# EAGLE design 3v3converter (EAGLE 6.6.0)
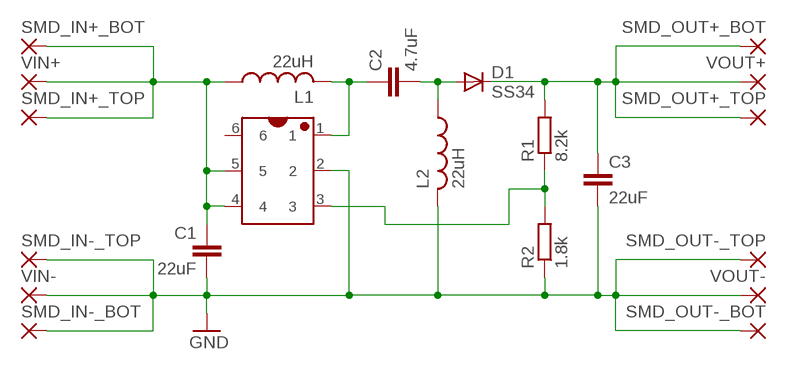
[diagram p0: schematic, sheet 1]

## Parts
C1  22uF  C-EUC0805  [C0805]
C2  4.7uF  C-EUC0603  [C0603]
C3  22uF  C-EUC0805  [C0805]
D1  SS34  DIODE-DO214BA  [DO214BA]
L1  22uH  L-USFPS  [FPS]
L2  22uH  L-USFPS  [FPS]
MT3608  mt3608  SOT-23-6  [SOT-23-6]
R1  8.2k  R-EU_R0603  [R0603]
R2  1.8k  R-EU_R0603  [R0603]
SMD_IN+_BOT  SMD5  [SMD2,54-5,08]
SMD_IN+_TOP  SMD5  [SMD2,54-5,08]
SMD_IN-_BOT  SMD5  [SMD2,54-5,08]
SMD_IN-_TOP  SMD5  [SMD2,54-5,08]
SMD_OUT+_BOT  SMD5  [SMD2,54-5,08]
SMD_OUT+_TOP  SMD5  [SMD2,54-5,08]
SMD_OUT-_BOT  SMD5  [SMD2,54-5,08]
SMD_OUT-_TOP  SMD5  [SMD2,54-5,08]
VIN+  1,6/0,9  [1,6/0,9]
VIN-  1,6/0,9  [1,6/0,9]
VOUT+  1,6/0,9  [1,6/0,9]
VOUT-  1,6/0,9  [1,6/0,9]

## Nets
GND: C1.2 C3.2 L2.P$2 MT3608.2 R2.1 SMD_IN-_BOT.1(P) SMD_IN-_TOP.1(P) SMD_OUT-_BOT.1(P) SMD_OUT-_TOP.1(P) VIN-.1(P) VOUT-.1(P)
N$1: C1.1 L1.P$1 MT3608.4 MT3608.5 SMD_IN+_BOT.1(P) SMD_IN+_TOP.1(P) VIN+.1(P)
N$3: C2.1 L1.P$2 MT3608.1
N$5: C2.2 D1.A L2.P$1
N$6: C3.1 D1.C R1.2 SMD_OUT+_BOT.1(P) SMD_OUT+_TOP.1(P) VOUT+.1(P)
N$8: MT3608.3 R1.1 R2.2
Unconnected: MT3608.6

## Library data of the parts
C1-C3 = rcl:C-EU: CAPACITOR, European symbol
D1 = diode:DIODE-: DIODE
L1 L2 = rcl:L-US: INDUCTOR, American symbol
MT3608 = smd-footprints:SOT-23-6
R1 R2 = rcl:R-EU_: RESISTOR, European symbol
SMD_IN+_BOT SMD_IN+_TOP SMD_IN-_BOT SMD_IN-_TOP SMD_OUT+_BOT SMD_OUT+_TOP SMD_OUT-_BOT SMD_OUT-_TOP = wirepad:SMD5: SMD PAD
VIN+ VIN- VOUT+ VOUT- = wirepad:1,6/0,9: THROUGH-HOLE PAD

## Board
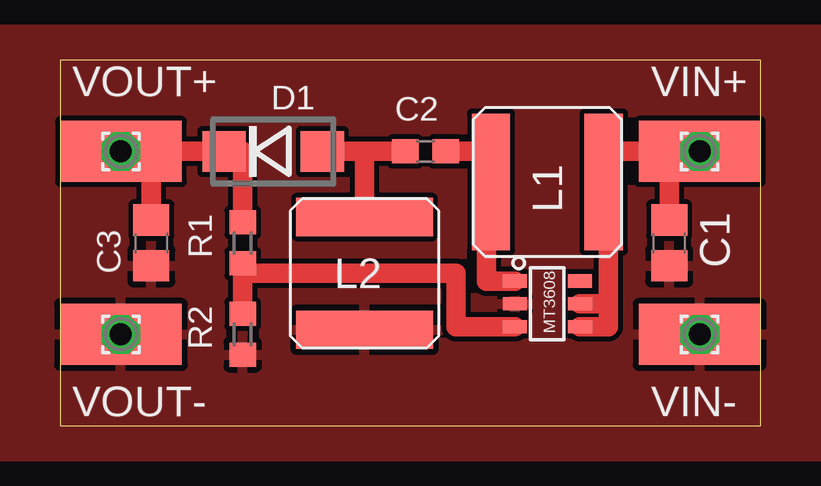
[diagram p1: board, top side]
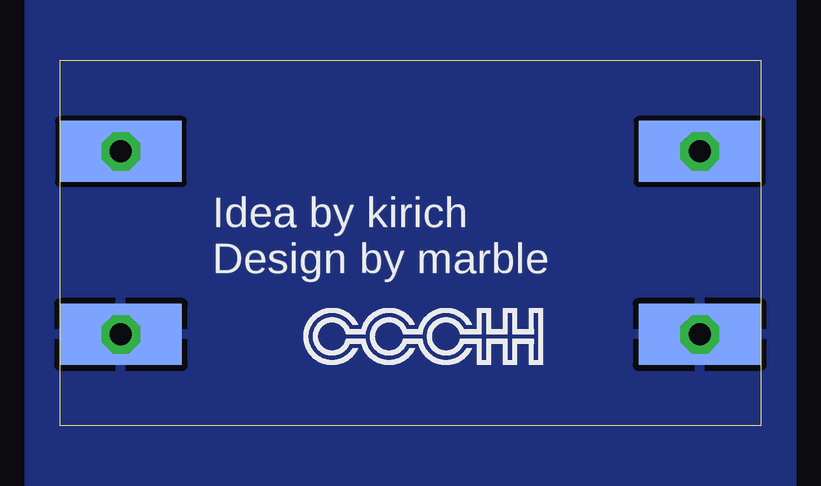
[diagram p2: board, bottom side, seen from below]

Size 29.21 x 15.24 mm. Coordinates in mm from the lower left corner, seen from the top.
Outline: 0,0 29.21,0 29.21,15.24 0,15.24 0,0
Copper layers (1*16): Top 0.035mm / dielectric 1.5mm / Bottom 0.035mm
Design rules "default *": minimum track width 10mil, minimum drill 24mil, track to track 8mil, track to pad 8mil, pad to pad 8mil, via to via 8mil, smd to smd 8mil, copper to edge 0mil, drill to drill 8mil, minimum pad ring 10mil, minimum via ring 8mil, stop-mask expansion 4mil, vias tented up to drill 0mil, thermal gap 10mil

### Footprints (pad centres in the part's own frame; a part is rotated, then mirrored left to right if it is on the bottom)
C0805 = smd 1.3 x 1.5: 1 -0.95,0; 2 0.95,0
C0603 = smd 1.1 x 1: 1 -0.85,0; 2 0.85,0
DO214BA = smd 1.8 x 1.7: A 2.05,0; C -2.05,0
FPS = smd 1.6 x 5.7: P$1 -2.35,0; P$2 2.35,0
SOT-23-6 = smd 1 x 0.55: 1 -1.35,0.95; 2 -1.35,0; 3 -1.35,-0.95; 4 1.35,-0.95; 5 1.35,0; 6 1.35,0.95
R0603 = smd 1 x 1.1: 1 -0.85,0; 2 0.85,0
SMD2,54-5,08 = smd 2.54 x 5.08: 1 0,0
1,6/0,9 = drill 0.914 pad 1.6 octagon: 1 0,0

### Placement (x,y rotation side)
C1  25.4,7.62 270 top
C2  15.24,11.43 180 top
C3  3.81,7.62 270 top
D1  8.89,11.43 0 top
L1  20.32,10.16 180 top
L2  12.7,6.35 270 top
MT3608  20.32,5.08 0 top
R1  7.62,7.62 90 top
R2  7.62,3.81 90 top
SMD_IN+_BOT  26.67,11.43 270 bottom
SMD_IN+_TOP  26.67,11.43 270 top
SMD_IN-_BOT  26.67,3.81 270 bottom
SMD_IN-_TOP  2.54,3.81 90 top
SMD_OUT+_BOT  2.54,11.43 90 bottom
SMD_OUT+_TOP  2.54,11.43 90 top
SMD_OUT-_BOT  2.54,3.81 270 bottom
SMD_OUT-_TOP  26.67,3.81 90 top
VIN+  26.67,11.43 0 top
VIN-  26.67,3.81 0 top
VOUT+  2.54,11.43 0 top
VOUT-  2.54,3.81 0 top

### Tracks (layer width: path | path; a pad name or v marks a point on that pad's centre or on a via)
GND
  pour Top: -2.54,-1.27 31.75,-1.27 31.75,16.51 -2.54,16.51
  pour Bottom: -1.27,-2.54 30.48,-2.54 30.48,17.78 -1.27,17.78
N$1
  Top 0.813: MT3608.4 22.86,4.13 22.86,5.08 | 22.86,5.08 MT3608.5 | 22.86,10.16 22.86,5.08 | 25.4,11.43 22.86,11.43 22.86,10.16 | 25.4,11.43 C1.1 | SMD_IN+_BOT.1 25.4,11.43 | 22.86,10.16 L1.P$1
N$3
  Top 0.813: MT3608.1 17.78,6.03 17.78,10.16 | C2.1 17.78,11.43 17.78,10.16 | 17.78,10.16 L1.P$2
N$5
  Top 0.813: D1.A 12.7,11.43 | C2.2 12.7,11.43 | 12.7,11.43 L2.P$1
N$6
  Top 0.813: R1.2 7.62,11.43 D1.C 3.81,11.43 | SMD_OUT+_BOT.1 3.81,11.43 | 3.81,11.43 C3.1
N$8
  Top 0.813: MT3608.3 16.51,4.13 16.51,6.35 7.62,6.35 | R2.2 7.62,6.35 | 7.62,6.35 R1.1

### Text on the board
bNames: Idea by kirich / Design by marble